# Altium schematic sheet 5V_to_3V3.SchDoc
size A4
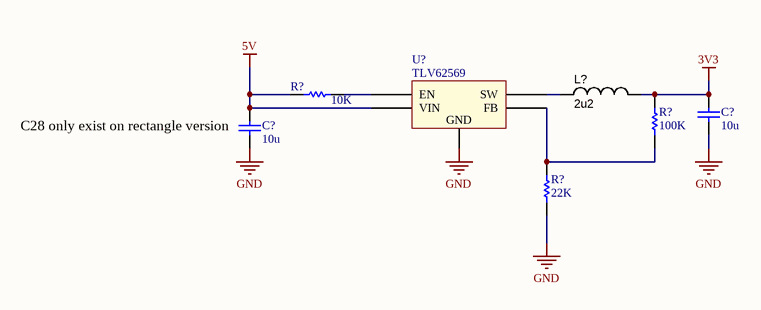
[diagram p0: 5V_to_3V3.SchDoc]

## Parts
(Parts that share a designator on the sheet are numbered #1, #2 ... from top to bottom, then left to right.)
C?#1  value 10u  [CAPC2012X135N]  (hidden comment: Cap)
C?#2  value 10u  [CAPC2012X135N]  (hidden comment: Cap)
L?  value 2u2  [INDM3225X240N]  (hidden comment: inductor)
R?#1  value 10K  [RESC1608X55N]  (hidden comment: Res1)
R?#2  value 100K  [RESC2012X70N]  (hidden comment: Res1)
R?#3  value 22K  [RESC2012X70N]  (hidden comment: Res1)
U?  TLV62569  [SOT23-5]

## Nets
3V3: C?#1.2 L?.2 R?#2.2
5V: C?#2.2 R?#1.1 U?.4(VIN)
GND: C?#1.1 C?#2.1 R?#3.2 U?.2(GND)
NetL?_1: L?.1 U?.3(SW)
NetR?#1_2: R?#1.2 U?.1(EN)
NetR?#2_1: R?#2.1 R?#3.1 U?.5(FB)

## Notes on the sheet
- (near C?#2) C28 only exist on rectangle version

## Library data of the parts
C?#1 C?#2 = Cap: Capacitor; Published: 8-Jun-2000; LatestRevisionDate: 17-Jul-2002; LatestRevisionNote: Re-released for DXP Platform.; PackageReference: RAD-0.3; Publisher: Altium Limited; PackageDescription: Radial Cap, Thru-Hole; 2 Leads; 0.3 in Pin Spacing
L? = INDC: IHLP SMD 4040; link: http://www.mouser.hk/ProductDetail/Panasonic/ETQ-P5M4R7YFC/?qs=sGAEpiMZZMsg%252by3WlYCkUx1BJssUTVH58rrEHsPkNus%3d
R?#1-R?#3 = Res1: Resistor; Published: 8-Jun-2000; LatestRevisionDate: 17-Jul-2002; LatestRevisionNote: Re-released for DXP Platform.; PackageReference: AXIAL-0.3; Publisher: Altium Limited; PackageDescription: Axial Device, Thru-Hole; 2 Leads; 0.3 in Pin Spacing
U? = TLV62569: 2-A High Efficiency Synchronous Buck Converter in SOT Package; Manufacturer: TI; Vin: 2.5-5.5V; Iout(max): 2A